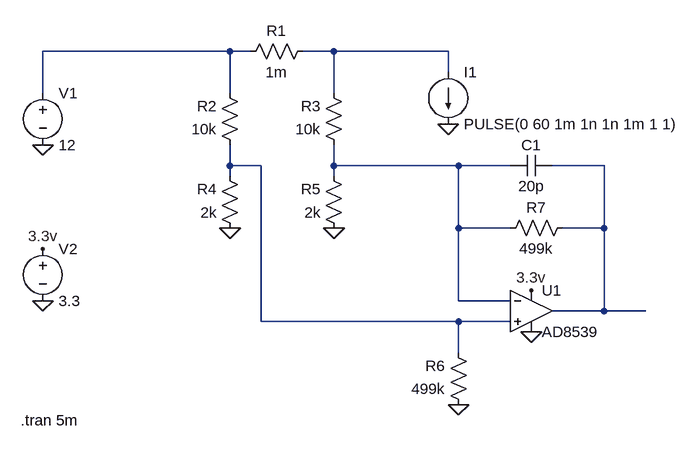
[diagram p0: schematic Current_Sense.asc]
Current_Sense.asc, the LTspice schematic file:
Version 4
SHEET 1 880 680
WIRE 64 48 -224 48
WIRE 96 48 64 48
WIRE 224 48 176 48
WIRE 400 48 224 48
WIRE 400 80 400 48
WIRE -224 112 -224 48
WIRE 64 112 64 48
WIRE 224 112 224 48
WIRE 64 224 64 192
WIRE 112 224 64 224
WIRE 224 224 224 192
WIRE 416 224 224 224
WIRE 496 224 416 224
WIRE 640 224 560 224
WIRE 64 240 64 224
WIRE 224 240 224 224
WIRE 416 320 416 224
WIRE 496 320 416 320
WIRE 640 320 640 224
WIRE 640 320 576 320
WIRE 416 432 416 320
WIRE 496 432 416 432
WIRE 640 448 640 320
WIRE 640 448 560 448
WIRE 704 448 640 448
WIRE 112 464 112 224
WIRE 416 464 112 464
WIRE 496 464 416 464
WIRE 416 512 416 464
FLAG -224 432 0
FLAG -224 192 0
FLAG 64 320 0
FLAG 224 320 0
FLAG 416 592 0
FLAG 528 480 0
FLAG 400 160 0
FLAG -224 352 3.3v
FLAG 528 416 3.3v
SYMBOL res 192 32 R90
WINDOW 0 0 56 VBottom 2
WINDOW 3 32 56 VTop 2
SYMATTR InstName R1
SYMATTR Value 1m
SYMBOL res 80 208 R180
WINDOW 0 36 76 Left 2
WINDOW 3 36 40 Left 2
SYMATTR InstName R2
SYMATTR Value 10k
SYMBOL res 240 208 R180
WINDOW 0 36 76 Left 2
WINDOW 3 36 40 Left 2
SYMATTR InstName R3
SYMATTR Value 10k
SYMBOL res 80 336 R180
WINDOW 0 36 76 Left 2
WINDOW 3 36 40 Left 2
SYMATTR InstName R4
SYMATTR Value 2k
SYMBOL res 240 336 R180
WINDOW 0 36 76 Left 2
WINDOW 3 36 40 Left 2
SYMATTR InstName R5
SYMATTR Value 2k
SYMBOL res 432 608 R180
WINDOW 0 36 76 Left 2
WINDOW 3 36 40 Left 2
SYMATTR InstName R6
SYMATTR Value 499k
SYMBOL res 480 336 R270
WINDOW 0 32 56 VTop 2
WINDOW 3 0 56 VBottom 2
SYMATTR InstName R7
SYMATTR Value 499k
SYMBOL Opamps\\AD8539 528 384 R0
SYMATTR InstName U1
SYMBOL voltage -224 96 R0
SYMATTR InstName V1
SYMATTR Value 12
SYMBOL voltage -224 336 R0
SYMATTR InstName V2
SYMATTR Value 3.3
SYMBOL current 400 80 R0
WINDOW 123 0 0 Left 0
WINDOW 39 0 0 Left 0
SYMATTR InstName I1
SYMATTR Value PULSE(0 60 1m 1n 1n 1m 1 1)
SYMBOL cap 560 208 R90
WINDOW 0 0 32 VBottom 2
WINDOW 3 32 32 VTop 2
SYMATTR InstName C1
SYMATTR Value 20p
TEXT -258 616 Left 2 !.tran 5m

The netlist it stands for:
* Current_Sense.asc
R1 N002 N001 1m
R2 N003 N001 10k
R3 N004 N002 10k
R4 0 N003 2k
R5 0 N004 2k
R6 0 N003 499k
R7 N004 N005 499k
XU1 N003 N004 3.3v 0 N005 AD8539  ; pins In+ In- V+ V- OUT
V1 N001 0 12
V2 3.3v 0 3.3
I1 N002 0 PULSE(0 60 1m 1n 1n 1m 1 1)
C1 N005 N004 20p
.tran 5m
.backanno
.end